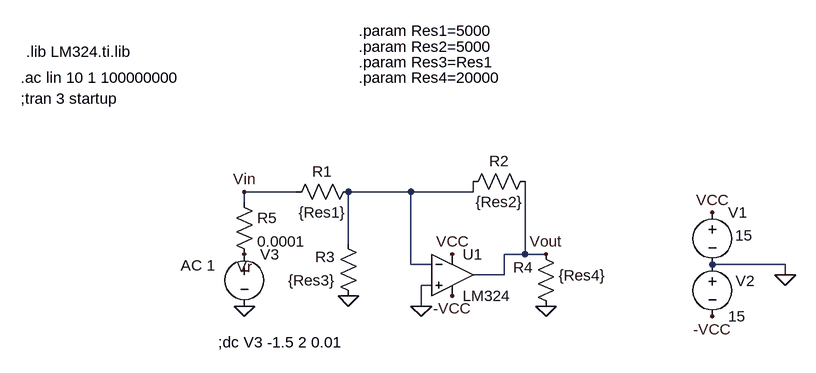
[diagram p0: schematic simulacion_a_caso2_impedanciaEntrada.asc]
simulacion_a_caso2_impedanciaEntrada.asc, the LTspice schematic file:
Version 4
SHEET 1 880 680
WIRE -128 0 -208 0
WIRE 48 0 -48 0
WIRE 144 0 144 -16
WIRE 144 0 48 0
WIRE -208 16 -208 0
WIRE -48 80 -48 0
WIRE 224 96 224 -16
WIRE 224 96 192 96
WIRE 256 96 224 96
WIRE 48 112 48 0
WIRE 80 112 48 112
WIRE 624 112 512 112
WIRE 192 128 192 96
WIRE 192 128 144 128
WIRE 624 128 624 112
WIRE 80 144 64 144
WIRE 64 176 64 144
FLAG 624 128 0
FLAG 512 32 VCC
FLAG 112 96 VCC
FLAG 112 160 -VCC
FLAG 512 192 -VCC
FLAG -208 176 0
FLAG -48 160 0
FLAG 64 176 0
FLAG 256 176 0
FLAG 256 96 Vout
FLAG -208 0 Vin
FLAG -208 96 Vr
SYMBOL Opamps\\opamp2 112 64 R0
SYMATTR InstName U1
SYMATTR Value LM324
SYMBOL voltage 512 16 R0
WINDOW 3 35 51 Left 2
WINDOW 123 0 0 Left 2
WINDOW 39 0 0 Left 2
SYMATTR Value 15
SYMATTR InstName V1
SYMBOL voltage 512 96 R0
WINDOW 0 36 41 Left 2
WINDOW 123 0 0 Left 2
WINDOW 39 0 0 Left 2
SYMATTR InstName V2
SYMATTR Value 15
SYMBOL voltage -208 80 R0
WINDOW 123 -98 33 Left 2
WINDOW 39 0 0 Left 2
SYMATTR Value2 AC 1
SYMATTR Value ""
SYMATTR InstName V3
SYMBOL res -32 -16 R90
WINDOW 0 0 56 VBottom 2
WINDOW 3 32 56 VTop 2
SYMATTR InstName R1
SYMATTR Value {Res1}
SYMBOL res 240 -32 R90
WINDOW 0 0 56 VBottom 2
WINDOW 3 32 56 VTop 2
SYMATTR InstName R2
SYMATTR Value {Res2}
SYMBOL res -32 176 R180
WINDOW 0 36 76 Left 2
WINDOW 3 36 40 Left 2
SYMATTR InstName R3
SYMATTR Value {Res3}
SYMBOL res 272 192 R180
WINDOW 0 36 76 Left 2
WINDOW 3 -76 63 Left 2
SYMATTR InstName R4
SYMATTR Value {Res4}
SYMBOL res -224 0 R0
SYMATTR InstName R5
SYMATTR Value 0.0001
TEXT -552 -144 Left 2 !;tran 3 startup
TEXT -544 -216 Left 2 !.lib LM324.ti.lib
TEXT -552 -176 Left 2 !.ac lin 10 1 100000000
TEXT -32 -248 Left 2 !.param Res1=5000
TEXT -32 -224 Left 2 !.param Res2=5000
TEXT -32 -200 Left 2 !.param Res3=Res1
TEXT -32 -176 Left 2 !.param Res4=20000
TEXT -248 232 Left 2 !;dc V3 -1.5 2 0.01

The netlist it stands for:
* simulacion_a_caso2_impedanciaEntrada.asc
XU1 0 N001 VCC -VCC Vout LM324  ; pins In+ In- V+ V- OUT
V1 VCC 0 15
V2 0 -VCC 15
V3 Vr 0 AC 1
R1 N001 Vin {Res1}
R2 Vout N001 {Res2}
R3 0 N001 {Res3}
R4 0 Vout {Res4}
R5 Vin Vr 0.0001
;tran 3 startup
.lib LM324.ti.lib
.ac lin 10 1 100000000
.param Res1=5000
.param Res2=5000
.param Res3=Res1
.param Res4=20000
;dc V3 -1.5 2 0.01
.backanno
.end